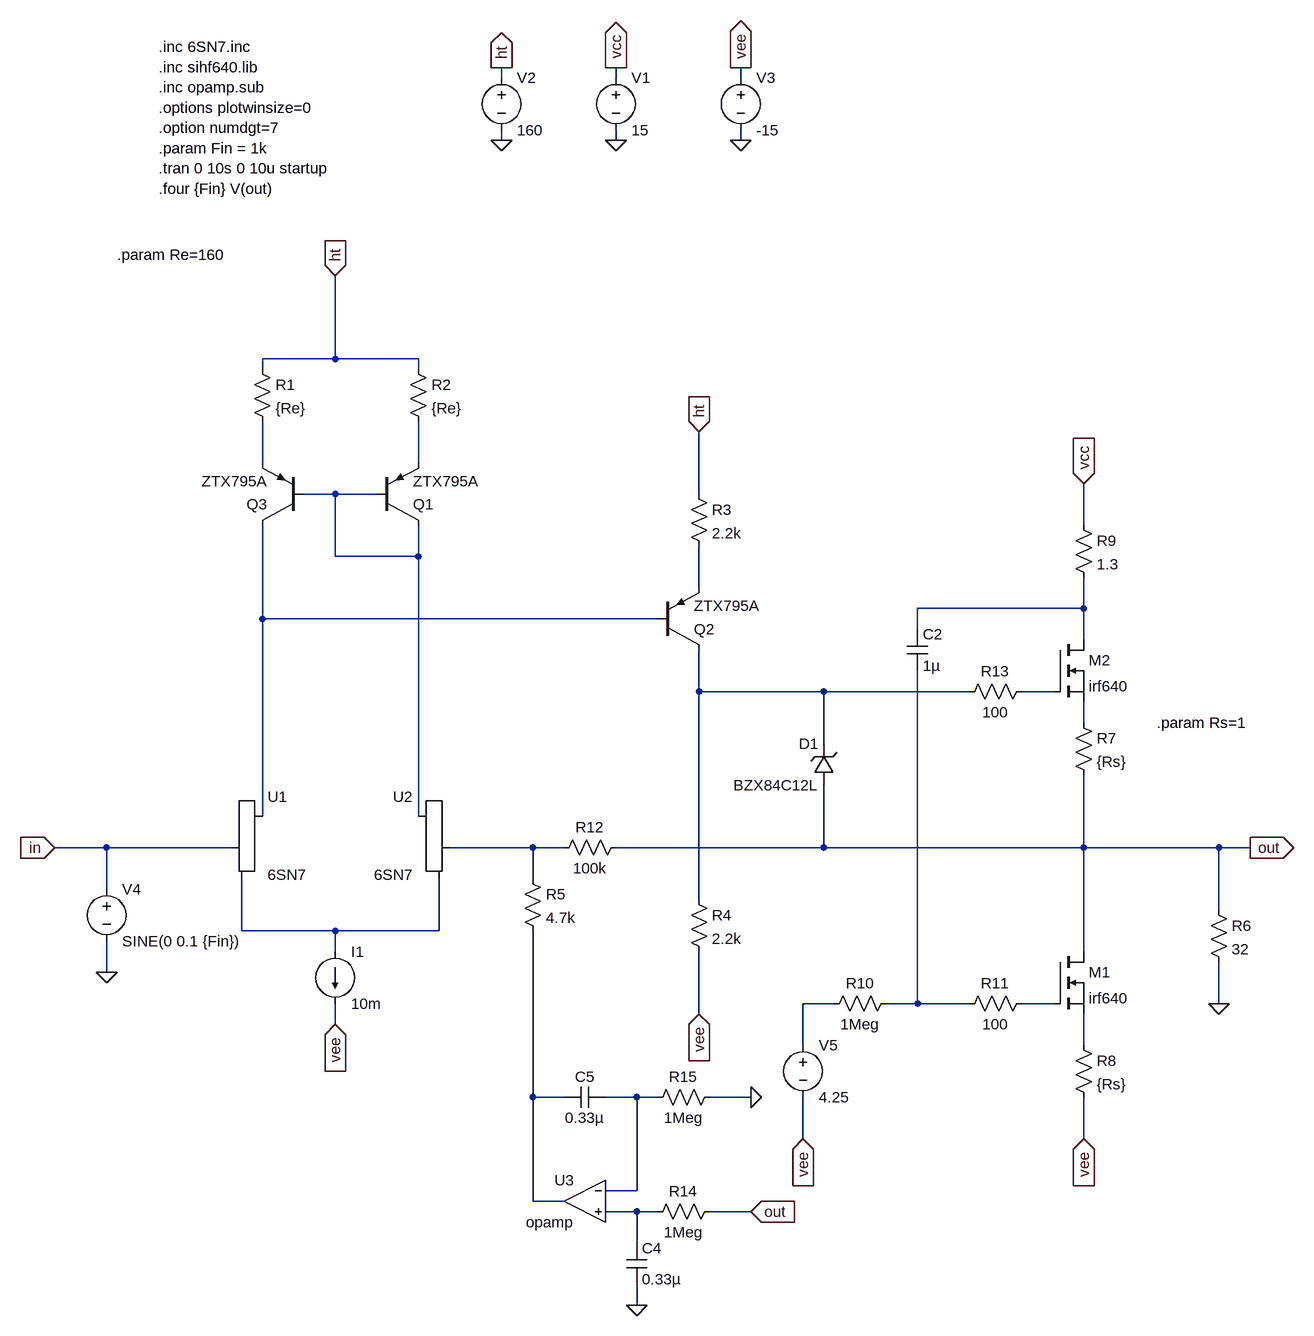
[diagram p0: schematic 6SN7 differential DC.asc]
6SN7 differential DC.asc, the LTspice schematic file:
Version 4
SHEET 1 2500 1520
WIRE 1104 -480 1104 -496
WIRE 1280 -480 1280 -496
WIRE 1472 -480 1472 -496
WIRE 1104 -384 1104 -400
WIRE 1280 -384 1280 -400
WIRE 1472 -384 1472 -400
WIRE 848 -48 848 -176
WIRE 848 -48 736 -48
WIRE 976 -48 848 -48
WIRE 736 -32 736 -48
WIRE 976 -32 976 -48
WIRE 736 112 736 48
WIRE 976 112 976 48
WIRE 848 160 800 160
WIRE 912 160 848 160
WIRE 1408 160 1408 64
WIRE 2000 208 2000 144
WIRE 848 256 848 160
WIRE 976 256 976 208
WIRE 976 256 848 256
WIRE 1408 304 1408 240
WIRE 2000 336 2000 288
WIRE 2000 336 1744 336
WIRE 736 352 736 208
WIRE 1344 352 736 352
WIRE 1744 368 1744 336
WIRE 2000 384 2000 336
WIRE 1408 464 1408 400
WIRE 1600 464 1408 464
WIRE 1824 464 1600 464
WIRE 1952 464 1904 464
WIRE 2000 512 2000 480
WIRE 1600 544 1600 464
WIRE 736 656 736 352
WIRE 976 656 976 256
WIRE 496 704 416 704
WIRE 688 704 496 704
WIRE 1152 704 1024 704
WIRE 1200 704 1152 704
WIRE 1600 704 1600 608
WIRE 1600 704 1280 704
WIRE 2000 704 2000 592
WIRE 2000 704 1600 704
WIRE 2208 704 2000 704
WIRE 2256 704 2208 704
WIRE 1152 752 1152 704
WIRE 496 768 496 704
WIRE 1408 784 1408 464
WIRE 2208 800 2208 704
WIRE 704 832 704 752
WIRE 848 832 704 832
WIRE 1008 832 1008 752
WIRE 1008 832 848 832
WIRE 848 864 848 832
WIRE 2000 864 2000 704
WIRE 496 896 496 848
WIRE 1616 944 1568 944
WIRE 1744 944 1744 432
WIRE 1744 944 1696 944
WIRE 1824 944 1744 944
WIRE 1952 944 1904 944
WIRE 2208 944 2208 880
WIRE 1408 960 1408 864
WIRE 848 976 848 944
WIRE 1568 1008 1568 944
WIRE 2000 1008 2000 960
WIRE 1152 1088 1152 832
WIRE 1200 1088 1152 1088
WIRE 1312 1088 1264 1088
WIRE 1344 1088 1312 1088
WIRE 1488 1088 1424 1088
WIRE 1568 1152 1568 1088
WIRE 2000 1152 2000 1088
WIRE 1312 1232 1312 1088
WIRE 1312 1232 1264 1232
WIRE 1152 1248 1152 1088
WIRE 1200 1248 1152 1248
WIRE 1312 1264 1264 1264
WIRE 1344 1264 1312 1264
WIRE 1488 1264 1424 1264
WIRE 1312 1312 1312 1264
WIRE 1312 1408 1312 1376
FLAG 416 704 in
IOPIN 416 704 In
FLAG 848 -176 ht
IOPIN 848 -176 In
FLAG 1280 -384 0
FLAG 1280 -496 vcc
IOPIN 1280 -496 Out
FLAG 1104 -384 0
FLAG 1104 -496 ht
IOPIN 1104 -496 Out
FLAG 1472 -384 0
FLAG 1472 -496 vee
IOPIN 1472 -496 Out
FLAG 848 976 vee
IOPIN 848 976 In
FLAG 496 896 0
FLAG 1408 960 vee
IOPIN 1408 960 In
FLAG 1408 64 ht
IOPIN 1408 64 In
FLAG 2208 944 0
FLAG 2256 704 out
IOPIN 2256 704 Out
FLAG 2000 144 vcc
IOPIN 2000 144 In
FLAG 1568 1152 vee
IOPIN 1568 1152 In
FLAG 2000 1152 vee
IOPIN 2000 1152 In
FLAG 1312 1408 0
FLAG 1488 1088 0
FLAG 1488 1264 out
IOPIN 1488 1264 In
SYMBOL Misc/triode 736 704 R0
SYMATTR InstName U1
SYMATTR Value 6SN7
SYMBOL Misc/triode 976 704 M0
SYMATTR InstName U2
SYMATTR Value 6SN7
SYMBOL current 848 864 R0
SYMATTR InstName I1
SYMATTR Value 10m
SYMBOL res 720 -48 R0
SYMATTR InstName R1
SYMATTR Value {Re}
SYMBOL res 960 -48 R0
SYMATTR InstName R2
SYMATTR Value {Re}
SYMBOL pnp 912 208 M180
SYMATTR InstName Q1
SYMATTR Value ZTX795A
SYMBOL voltage 1280 -496 R0
SYMATTR InstName V1
SYMATTR Value 15
SYMBOL voltage 1104 -496 R0
SYMATTR InstName V2
SYMATTR Value 160
SYMBOL voltage 1472 -496 R0
SYMATTR InstName V3
SYMATTR Value -15
SYMBOL voltage 496 752 R0
SYMATTR InstName V4
SYMATTR Value SINE(0 0.1 {Fin})
SYMATTR Value2 AC 1
SYMBOL pnp 800 208 R180
SYMATTR InstName Q3
SYMATTR Value ZTX795A
SYMBOL res 1296 688 R90
WINDOW 0 0 56 VBottom 2
WINDOW 3 32 56 VTop 2
SYMATTR InstName R12
SYMATTR Value 100k
SYMBOL res 1136 736 R0
SYMATTR InstName R5
SYMATTR Value 4.7k
SYMBOL pnp 1344 400 M180
SYMATTR InstName Q2
SYMATTR Value ZTX795A
SYMBOL res 1392 144 R0
SYMATTR InstName R3
SYMATTR Value 2.2k
SYMBOL res 1392 768 R0
SYMATTR InstName R4
SYMATTR Value 2.2k
SYMBOL res 2192 784 R0
SYMATTR InstName R6
SYMATTR Value 32
SYMBOL nmos 1952 864 R0
SYMATTR InstName M1
SYMATTR Value irf640
SYMATTR Prefix X
SYMBOL nmos 1952 384 R0
SYMATTR InstName M2
SYMATTR Value irf640
SYMATTR Prefix X
SYMBOL res 1984 496 R0
SYMATTR InstName R7
SYMATTR Value {Rs}
SYMBOL res 1984 992 R0
SYMATTR InstName R8
SYMATTR Value {Rs}
SYMBOL res 1984 192 R0
SYMATTR InstName R9
SYMATTR Value 1.3
SYMBOL cap 1728 368 R0
SYMATTR InstName C2
SYMATTR Value 1µ
SYMBOL res 1712 928 R90
WINDOW 0 0 56 VBottom 2
WINDOW 3 32 56 VTop 2
SYMATTR InstName R10
SYMATTR Value 1Meg
SYMBOL voltage 1568 992 R0
SYMATTR InstName V5
SYMATTR Value 4.25
SYMBOL res 1920 928 R90
WINDOW 0 0 56 VBottom 2
WINDOW 3 32 56 VTop 2
SYMATTR InstName R11
SYMATTR Value 100
SYMBOL res 1920 448 R90
WINDOW 0 0 56 VBottom 2
WINDOW 3 32 56 VTop 2
SYMATTR InstName R13
SYMATTR Value 100
SYMBOL zener 1616 608 R180
WINDOW 0 24 64 Left 2
WINDOW 3 24 0 Left 2
SYMATTR InstName D1
SYMATTR Value BZX84C12L
SYMBOL Opamps/opamp 1232 1184 M0
SYMATTR InstName U3
SYMBOL res 1440 1248 R90
WINDOW 0 0 56 VBottom 2
WINDOW 3 32 56 VTop 2
SYMATTR InstName R14
SYMATTR Value 1Meg
SYMBOL cap 1296 1312 R0
SYMATTR InstName C4
SYMATTR Value 0.33µ
SYMBOL cap 1264 1072 R90
WINDOW 0 0 32 VBottom 2
WINDOW 3 32 32 VTop 2
SYMATTR InstName C5
SYMATTR Value 0.33µ
SYMBOL res 1440 1072 R90
WINDOW 0 0 56 VBottom 2
WINDOW 3 32 56 VTop 2
SYMATTR InstName R15
SYMATTR Value 1Meg
TEXT 576 -528 Left 2 !.inc 6SN7.inc\n.inc sihf640.lib\n.inc opamp.sub\n.options plotwinsize=0\n.option numdgt=7\n.param Fin = 1k\n.tran 0 10s 0 10u startup\n.four {Fin} V(out)
TEXT 512 -208 Left 2 !.param Re=160
TEXT 2112 512 Left 2 !.param Rs=1

The netlist it stands for:
* 6SN7 differential DC.asc
XU1 N006 in N011 6SN7
XU2 N003 N010 N011 6SN7
I1 N011 vee 10m
R1 ht N001 {Re}
R2 ht N002 {Re}
Q1 N003 N003 N002 0 ZTX795A
V1 vcc 0 15
V2 ht 0 160
V3 vee 0 -15
V4 in 0 SINE(0 0.1 {Fin}) AC 1
Q3 N006 N003 N001 0 ZTX795A
R12 out N010 100k
R5 N010 N016 4.7k
Q2 N007 N006 N004 0 ZTX795A
R3 ht N004 2.2k
R4 N007 vee 2.2k
R6 out 0 32
XM1 out N014 N015 irf640  ; pins D G S
XM2 N005 N008 N009 irf640  ; pins D G S
R7 N009 out {Rs}
R8 N015 vee {Rs}
R9 vcc N005 1.3
C2 N005 N013 1µ
R10 N013 N012 1Meg
V5 N012 vee 4.25
R11 N014 N013 100
R13 N008 N007 100
D1 out N007 BZX84C12L
XU3 N017 N018 N016 opamp Aol=100K GBW=10Meg  ; pins invin noninvin out
R14 out N018 1Meg
C4 N018 0 0.33µ
C5 N017 N016 0.33µ
R15 0 N017 1Meg
.model D D
.lib standard.dio
.model NPN NPN
.model PNP PNP
.lib standard.bjt
.inc 6SN7.inc
.inc sihf640.lib
.inc opamp.sub
.options plotwinsize=0
.option numdgt=7
.param Fin = 1k
.tran 0 10s 0 10u startup
.four {Fin} V(out)
.param Re=160
.param Rs=1
.backanno
.end